# EAGLE design converter (EAGLE 7.4.0)

## Sheet 1 of 2: AEKII side
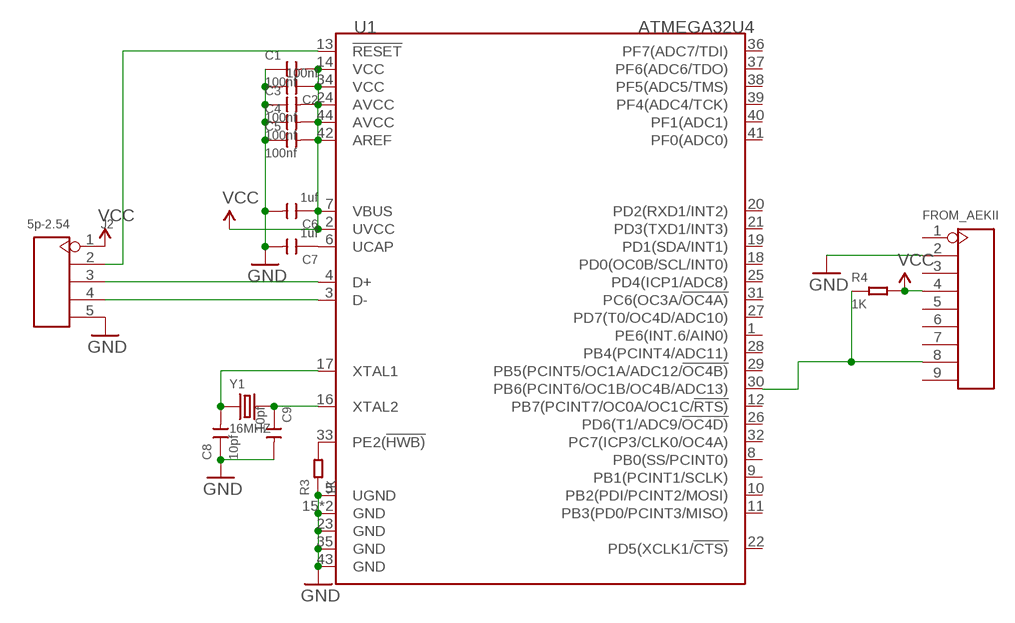
[diagram p0: schematic, sheet 1]

### Parts
C1  100nf  CERAMIC-100NF-50V-10%-X7R(0603)  [C0603]
C2  100nf  CERAMIC-100NF-50V-10%-X7R(0603)  [C0603]
C3  100nf  CERAMIC-100NF-50V-10%-X7R(0603)  [C0603]
C4  100nf  CERAMIC-100NF-50V-10%-X7R(0603)  [C0603]
C5  100nf  CERAMIC-100NF-50V-10%-X7R(0603)  [C0603]
C6  1uf  CERAMIC-1UF-25V-10%-X7R(0603)  [C0603]
C7  1uf  CERAMIC-1UF-25V-10%-X7R(0603)  [C0603]
C8  10pf  CERAMIC-10PF-50V-5%-NPO(0603)  [C0603]
C9  10pf  CERAMIC-10PF-50V-5%-NPO(0603)  [C0603]
FROM_AEKII  DIP-BLACK-FEMALE-HEADER-VERT(9P-2.0)  [H9-2.0]
J2  5p-2.54  DIP-BLACK-FEMALE-HEADER-VERT(5P-2.54)  [H5-2.54]
R3  1K  SMD-RES-1K-1%-1/10W(0603)  [R0603]
R4  1K  SMD-RES-1K-1%-1/10W(0603)  [R0603]
U1  ATMEGA32U4  MCU-ATMEGA32U4-MUR(VQFN44)  [QFN44G-0.5-7X7MM]
Y1  16MHZ  SMD-CRYSTAL-16MHZ-8PF-20PPM-40R(2P-5.0X3.2MM)  [X2-SMD-5.0X3.2X1.3MM]

### Nets
DATA: FROM_AEKII.8 R4.1 U1.30(PB6(PCINT6/OC1B/OC4B/ADC13))
GND: C1.1 C2.2 C3.1 C4.1 C5.1 C6.2 C7.2 C8.1 C9.2 FROM_AEKII.2 J2.5 R3.1 U1.5(UGND) U1.15(GND) U1.23(GND) U1.35(GND) U1.43(GND) U1.TAB(GND) ; also sheet 2
N$1: C7.1 U1.6(UCAP)
N$3: J2.3 U1.4(D+)
N$4: J2.4 U1.3(D-)
N$11: C8.2 U1.17(XTAL1) Y1.1
N$12: C9.1 U1.16(XTAL2) Y1.2
N$13: R3.2 U1.33(PE2(!HWB))
RESET: J2.2 U1.13(!RESET)
VCC: C1.2 C2.1 C3.2 C4.2 C5.2 C6.1 FROM_AEKII.4 J2.1 R4.2 U1.2(UVCC) U1.7(VBUS) U1.14(VCC) U1.24(AVCC) U1.34(VCC) U1.42(AREF) U1.44(AVCC) ; also sheet 2
Unconnected: FROM_AEKII.1 FROM_AEKII.3 FROM_AEKII.5 FROM_AEKII.6 FROM_AEKII.7 FROM_AEKII.9 U1.1(PE6(INT.6/AIN0)) U1.8(PB0(SS/PCINT0)) U1.9(PB1(PCINT1/SCLK)) U1.10(PB2(PDI/PCINT2/MOSI)) U1.11(PB3(PD0/PCINT3/MISO)) U1.12(PB7(PCINT7/OC0A/OC1C/!RTS)) U1.18(PD0(OC0B/SCL/INT0)) U1.19(PD1(SDA/INT1)) U1.20(PD2(RXD1/INT2)) U1.21(PD3(TXD1/INT3)) U1.22(PD5(XCLK1/!CTS)) U1.25(PD4(ICP1/ADC8)) U1.26(PD6(T1/ADC9/!OC4D)) U1.27(PD7(T0/OC4D/ADC10)) U1.28(PB4(PCINT4/ADC11)) U1.29(PB5(PCINT5/OC1A/ADC12/!OC4B)) U1.31(PC6(OC3A/!OC4A)) U1.32(PC7(ICP3/CLK0/OC4A)) U1.36(PF7(ADC7/TDI)) U1.37(PF6(ADC6/TDO)) U1.38(PF5(ADC5/TMS)) U1.39(PF4(ADC4/TCK)) U1.40(PF1(ADC1)) U1.41(PF0(ADC0))

## Sheet 2 of 2: LH USB
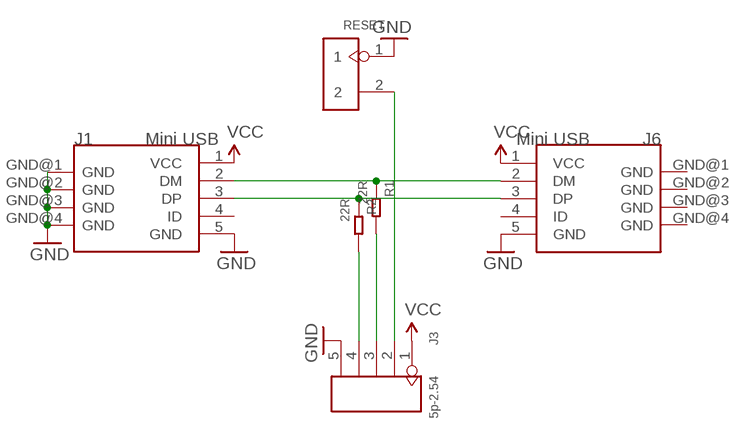
[diagram p1: schematic, sheet 2]

### Parts
J1  Mini USB  MINI-USB2.0-RECEPT-5POS-4-LEGS-(ST-USB-013A)  [MINIUSB5+4P-0.8-90D]
J3  5p-2.54  DIP-BLACK-FEMALE-HEADER-VERT(5P-2.54)  [H5-2.54]
J6  Mini USB  MINI-USB2.0-RECEPT-5POS-4-LEGS-(ST-USB-013A)  [MINIUSB5+4P-0.8-90D]
R1  22R  SMD-RES-22R-5%-1/10W(0603)  [R0603]
R2  22R  SMD-RES-22R-5%-1/10W(0603)  [R0603]
RESET  DIP-BLACK-FEMALE-HEADER-VERT(2P-2.54)  [H2-2.54]

### Nets
GND: J1.5(GND) J1.GND@1(GND) J1.GND@2(GND) J1.GND@3(GND) J1.GND@4(GND) J3.5 J6.5(GND) RESET.1 ; also sheet 1
N$2: J3.2 RESET.2
N$5: J3.3 R1.2
N$6: J3.4 R2.2
USB_N [USB]: J1.2(DM) J6.2(DM) R1.1
USB_P [USB]: J1.3(DP) J6.3(DP) R2.1
VCC: J1.1(VCC) J3.1 J6.1(VCC) ; also sheet 1
Unconnected: J1.4(ID) J6.4(ID) J6.GND@1(GND) J6.GND@2(GND) J6.GND@3(GND) J6.GND@4(GND)

## Library data of the parts
C1-C5 = Seeed-OPL-Capacitor:CERAMIC-100NF-50V-10%-X7R(0603): 302010138; MPN: CC0603KRX7R9BB104
C6 C7 = Seeed-OPL-Capacitor:CERAMIC-1UF-25V-10%-X7R(0603): 302010139; MPN: CC0603KRX7R8BB105
C8 C9 = Seeed-OPL-Capacitor:CERAMIC-10PF-50V-5%-NPO(0603): 302010097
FROM_AEKII = Seeed-OPL-Connector:DIP-BLACK-FEMALE-HEADER-VERT(9P-2.0): 320030018
J1 J6 = Seeed-OPL-Connector:MINI-USB2.0-RECEPT-5POS-4-LEGS-(ST-USB-013A): 320010014; MPN: ST-USB-013A
J2 J3 = Seeed-OPL-Connector:DIP-BLACK-FEMALE-HEADER-VERT(5P-2.54): 320030028; MPN: F185-1105A0BSYA1
R1 R2 = Seeed-OPL-Resistor:SMD-RES-22R-5%-1/10W(0603): 301010289; MPN: RC0603JR-0722RL
R3 R4 = Seeed-OPL-Resistor:SMD-RES-1K-1%-1/10W(0603): 301010298; MPN: RC0603FR-071KL
RESET = Seeed-OPL-Connector:DIP-BLACK-FEMALE-HEADER-VERT(2P-2.54): 320030023; MPN: F185-1102A1BSYA1
U1 = Seeed-OPL-ic:MCU-ATMEGA32U4-MUR(VQFN44): 310010016; MPN: ATMEGA32U4-MUR
Y1 = Seeed-OPL-crystal-osctllator:SMD-CRYSTAL-16MHZ-8PF-20PPM-40R(2P-5.0X3.2MM): 306010054; MPN: X053201602002

## Board
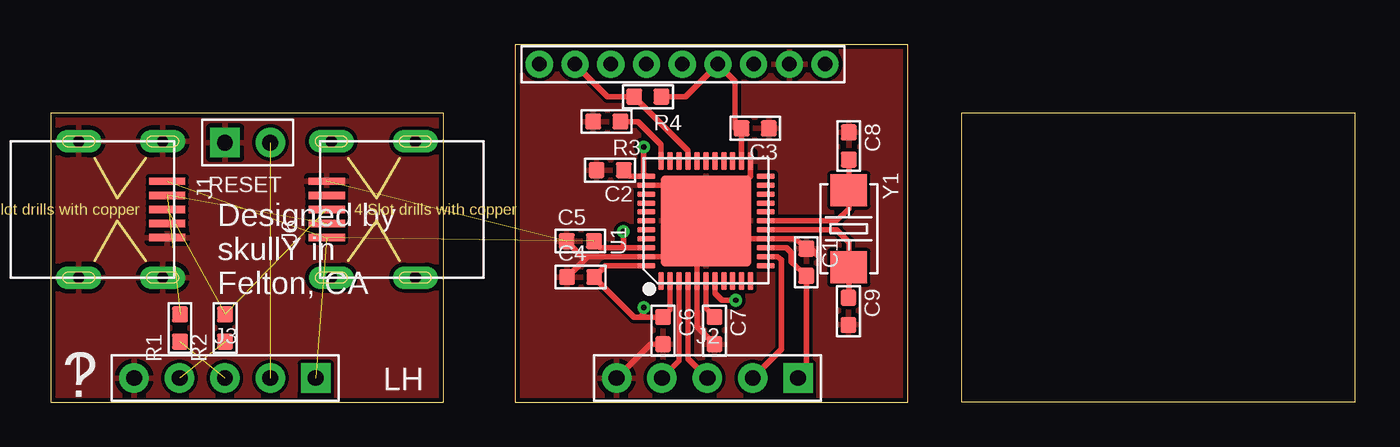
[diagram p2: board, top side]
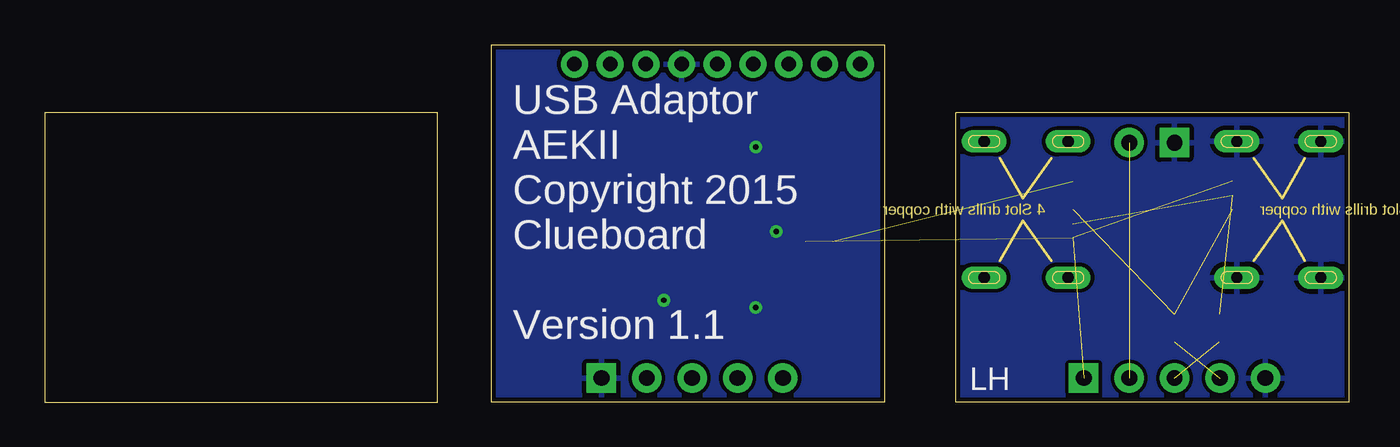
[diagram p3: board, bottom side, seen from below]

Size 73 x 20 mm. Coordinates in mm from the lower left corner, seen from the top.
Outline: 26,0 48,0 48,20 26,20 26,0
Outline: 0,16.2 0,0 22,0 22,16.2 0,16.2
Outline: 51,16.2 73,16.2 73,0 51,0 51,16.2
Copper layers (1*16): Top 0.035mm / dielectric 1.5mm / Bottom 0.035mm
Design rules "SeeedStudio_2layer_DRU_no_angle_20140221 *": minimum track width 0.2mm, minimum drill 12mil, track to track 0.2mm, track to pad 0.2mm, pad to pad 0.2mm, via to via 0.2mm, smd to smd 0mil, copper to edge 10mil, drill to drill 10mil, minimum pad ring 10mil, minimum via ring 0.2mm, stop-mask expansion 2mil, vias tented up to drill 100mil, thermal gap 10mil

### Footprints (pad centres in the part's own frame; a part is rotated, then mirrored left to right if it is on the bottom)
C0603 = smd 0.889 x 0.889: 1 0,0.762; 2 0,-0.762
H9-2.0 = drill 0.813 pad 1.524: 1 0,7; 2 0,5; 3 0,3; 4 0,1; 5 0,-1; 6 0,-3; 7 0,-5; 8 0,-7; 9 0,-9
MINIUSB5+4P-0.8-90D = smd 2.032 x 0.406: 1 0.381,-1.575; 2 0.381,-0.787; 3 0.381,0; 4 0.381,0.787; 5 0.381,1.575 | drill 0.635 pad 1.27 long: GND@1 0.635,3.81; GND@2 5.334,3.81; GND@3 5.334,-3.81; GND@4 0.635,-3.81
H5-2.54 = drill 0.889 pad 1.651 square: 1 0,5.08 | drill 0.889 pad 1.651: 2 0,2.54; 3 0,0; 4 0,-2.54; 5 0,-5.08
R0603 = smd 0.889 x 0.889: 1 0,0.762; 2 0,-0.762
H2-2.54 = drill 0.889 pad 1.651 square: 1 0,1.27 | drill 0.889 pad 1.651: 2 0,-1.27
QFN44G-0.5-7X7MM = smd 1 x 0.3: 1 -3.35,2.5; 2 -3.35,2; 3 -3.35,1.5; 4 -3.35,1; 5 -3.35,0.5; 6 -3.35,0; 7 -3.35,-0.5; 8 -3.35,-1; 9 -3.35,-1.5; 10 -3.35,-2; 11 -3.35,-2.5; 23 3.35,-2.5; 24 3.35,-2; 25 3.35,-1.5; 26 3.35,-1; 27 3.35,-0.5; 28 3.35,0; 29 3.35,0.5; 30 3.35,1; 31 3.35,1.5; 32 3.35,2; 33 3.35,2.5 | smd 0.3 x 1: 12 -2.5,-3.35; 13 -2,-3.35; 14 -1.5,-3.35; 15 -1,-3.35; 16 -0.5,-3.35; 17 0,-3.35; 18 0.5,-3.35; 19 1,-3.35; 20 1.5,-3.35; 21 2,-3.35; 22 2.5,-3.35; 34 2.5,3.35; 35 2,3.35; 36 1.5,3.35; 37 1,3.35; 38 0.5,3.35; 39 0,3.35; 40 -0.5,3.35; 41 -1,3.35; 42 -1.5,3.35; 43 -2,3.35; 44 -2.5,3.35 | smd 5.08 x 5.08: TAB 0,0
X2-SMD-5.0X3.2X1.3MM = smd 1.778 x 2.032: 1 -2.159,0; 2 2.159,0

### Placement (x,y rotation side)
C1  42.3,7.83 0 top
C2  31.32,12.98 270 top
C3  39.44,15.32 270 top
C4  29.67,7 90 top
C5  29.65,9.01 90 top
C6  34.28,4 0 top
C7  37.16,4 0 top
C8  44.68,14.33 0 top
C9  44.66,5.08 0 top
FROM_AEKII  36.35,18.91 270 top
J1  6.91,10.78 180 top
J2  36.76,1.35 270 top
J3  9.76,1.35 270 top
J6  15.08,10.78 0 top
R1  7.25,4.15 0 top
R2  9.77,4.15 0 top
R3  31.13,15.7 90 top
R4  33.43,17.09 90 top
RESET  11.03,14.52 90 top
U1  36.68,10.14 90 top
Y1  44.68,9.7 270 top

### Tracks (layer width: path | path; a pad name or v marks a point on that pad's centre or on a via)
DATA
  Top 0.3: FROM_AEKII.8 31.17,17.09 R4.1 35.68,14.08 U1.30
GND  (1 unrouted)
  Top 0.3: U1.TAB 37.68,9.14 U1.15 41.68,9.14 C1.1 42.55,8.59 43.14,8 | U1.23 39.18,12.64 U1.TAB | U1.TAB 36.18,9.64 U1.5 36.18,4.23 C7.2 | U1.35 34.68,12.14 U1.TAB | U1.TAB 34.68,8.14 U1.43 30,8.14 | 44.66,15.11 C8.1 | 30.65,12.98 C2.2 | C5.1 29.76,8.14 30,8.14 | C4.1 30,8.09 30,8.14 | J2.5 33.57,3.24 C6.2
  pour Top: 26,20 48,20 48,0 26,0
  pour Top: 0,0 22,0 22,16.2 0,16.2
  pour Bottom: 0,0 22,0 22,16.2 0,16.2
N$1
  Top 0.3: C7.1 36.68,5.25 U1.6
N$2  (1 unrouted)
N$3
  Top 0.3: U1.4 35.68,2.43 J2.3
N$4
  Top 0.3: U1.3 35.18,2.31 J2.4
N$5  (1 unrouted)
N$6  (1 unrouted)
N$11
  Top 0.3: U1.17 44,10.14 44.68,10.82 Y1.1 C8.2
N$12
  Top 0.3: U1.16 44,9.64 44.68,8.96 Y1.2 44.68,5.86 C9.1
N$13
  Top 0.3: U1.33 34.18,14.41 32.89,15.7 R3.2
RESET
  Top 0.3: U1.13 40.69,8.14 40.9,7.96 40.9,2.95 J2.2
USB_N  (2 unrouted)
USB_P  (2 unrouted)
VCC  (via drill 0.3)  (3 unrouted)
  Top 0.3: R4.2 35.53,17.09 FROM_AEKII.4 38.3,17.96 38.3,15.32 C3.2 U1.24 | U1.14 41.18,8.64 41.44,8.38 41.44,7.86 C1.2 42.3,1.81 J2.1 | C2.1 32.42,12.64 U1.34 33.2,12.77 v33.2,14.27 | U1.42 32,8.64 | 32,8.64 30.78,8.64 C5.2 | U1.44 31.07,7.64 C4.2 32.67,4.76 33,4.76 | U1.2 34.68,5.16 C6.1 33,4.76 | U1.7 37.18,6.09 37.57,5.7 v38.34,5.7 | v33.2,5.3 33.2,4.96 33,4.76 | v32.06,9.54 32.06,8.7 32,8.64
  pour Bottom: 26,20 48,20 48,0 26,0

### Text on the board
tPlace: Designed by / skullY in / Felton, CA | LH | ?
bPlace: USB Adaptor / AEKII / Copyright 2015 / Clueboard / / Version 1.1 | LH